# Altium project differential receiver.PrjPcb
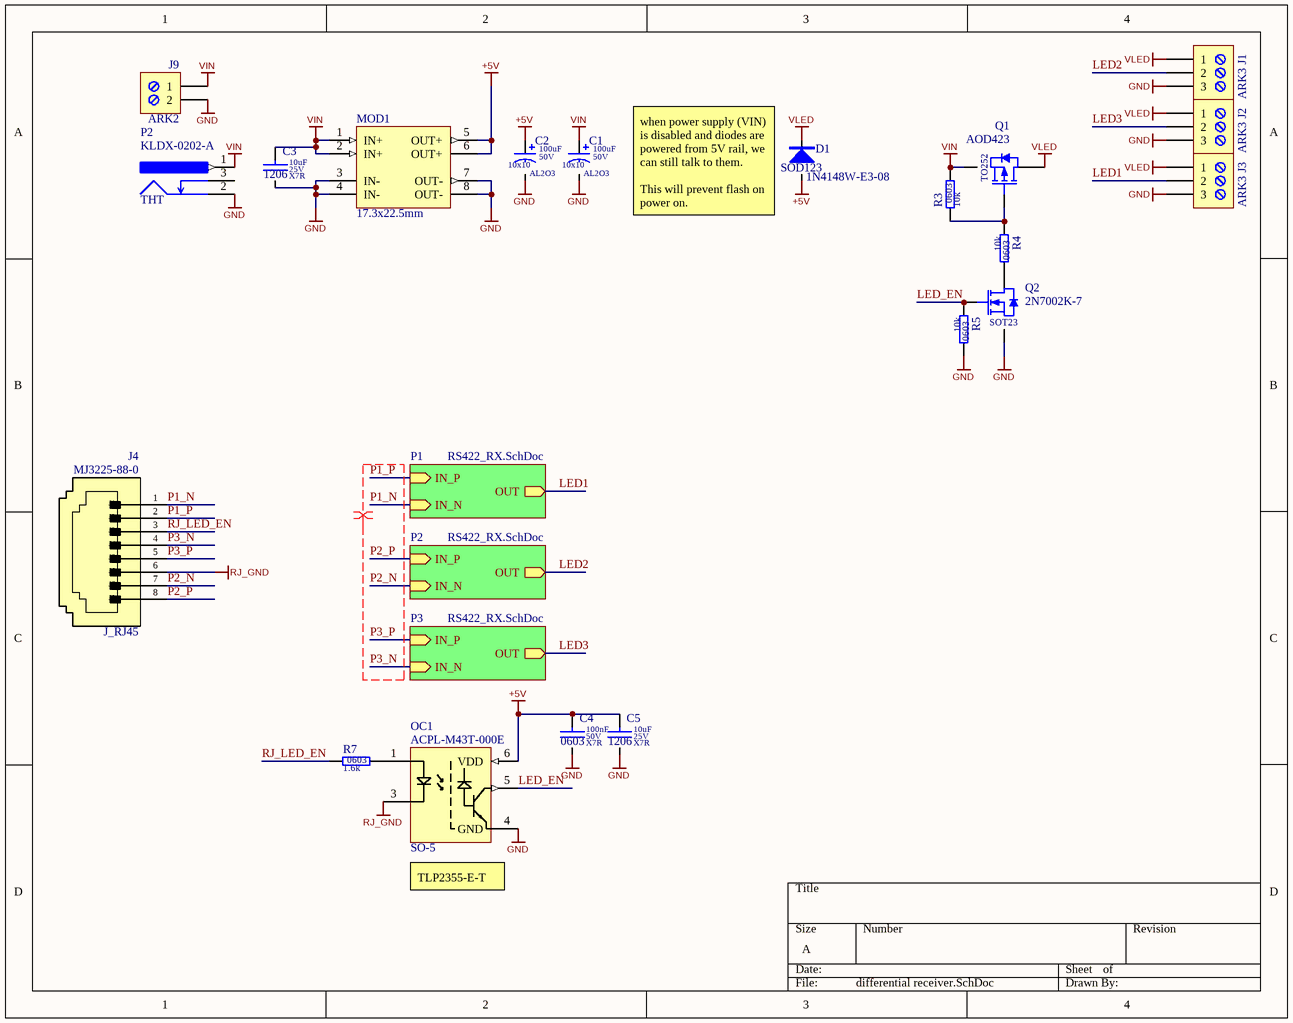
[diagram p0: differential receiver.SchDoc]
2 sheets, 38 parts. Net scope: hierarchical (ports join the sheet entries above them; power ports are global).
Board file: differential receiver.PcbDoc
Sheets:
  differential receiver.SchDoc
    P1 = RS422_RX.SchDoc
    P2 = RS422_RX.SchDoc
    P3 = RS422_RX.SchDoc

## Sheet differential receiver.SchDoc
size A; SheetNumber: 1; SheetTotal: 2

### Parts
(Parts that share a designator on the sheet are numbered #1, #2 ... from top to bottom, then left to right.)
C1  value 100uF  Dielectric: AL2O3  SCH_Footprint: 10x10  Voltage: 50V  [CE_D_10x10_SMD]  (hidden comment: Electrolytic Capacitor)
C2  value 100uF  Dielectric: AL2O3  SCH_Footprint: 10x10  Voltage: 50V  [CE_D_10x10_SMD]  (hidden comment: Electrolytic Capacitor)
C3  value 10uF  Dielectric: X7R  Voltage: 25V  SCH_Footprint: 1206  [C_1206_3216]  (hidden comment: Ceramic X7R)
C4#1  value 100nF  Dielectric: X7R  Voltage: 50V  SCH_Footprint: 0603  [C_0603_1608]  (hidden comment: Ceramic X7R)
C5#1  value 10uF  Dielectric: X7R  Voltage: 25V  SCH_Footprint: 1206  [C_1206_3216]  (hidden comment: Ceramic X7R)
D1  value 1N4148W-E3-08  [SOD123]  (hidden comment: 1N4148W)
J1  ARK3  [J_ARK3]
J2  ARK3  [J_ARK3]
J3  ARK3  [J_ARK3]
J4  value MJ3225-88-0  [J_RJ45_MJ3225-88-0]  (hidden comment: Modular Connector, Modular Jack, 1 x 1 (Port), 8P8C, Cat3)
J9  ARK2  [J_ARK2]
MOD1  SCH_Footprint: 17.3x22.5mm  [MOD_BUCK_MP1584]  (hidden comment: Low cost, Aliexpress-ready DC-DC buck converter using MP1584)
OC1  value ACPL-M43T-000E  [SO-5]  (hidden comment: Optocoupler DC-IN 1-CH Transistor With Base DC-OUT Automotive)
P2  value KLDX-0202-A  SCH_Footprint: THT  [P_KLDX-0202-A]  (hidden comment: DC JACK)
Q1  SCH_Footprint: TO252  [DPAK_TO252-3_SC63_M]  (hidden comment: AOD423)
Q2  SCH_Footprint: SOT23  [SOT23_TO236_SC59]  (hidden comment: 2N7002K-7)
R3  value 10k  SCH_Footprint: 0603  [R_0603_1608]  (hidden comment: Resistor)
R4  value 10k  SCH_Footprint: 0603  [R_0603_1608]  (hidden comment: Resistor)
R5  value 10k  SCH_Footprint: 0603  [R_0603_1608]  (hidden comment: Resistor)
R7#1  value 1.6k  SCH_Footprint: 0603  [R_0603_1608]  (hidden comment: Resistor)

### Sub-sheets
P1 = RS422_RX.SchDoc: OUT (out), IN_P (in), IN_N (in)
P2 = RS422_RX.SchDoc: OUT (out), IN_P (in), IN_N (in)
P3 = RS422_RX.SchDoc: OUT (out), IN_P (in), IN_N (in)

### Nets
+5V: C2.1 C4#1.1 C5#1.1 D1.2 MOD1.5(OUT+) MOD1.6(OUT+) OC1.6(VDD)
GND: C1.2 C2.2 C3.2 C4#1.2 C5#1.2 J1.3 J2.3 J3.3 J9.2 MOD1.3(IN-) MOD1.4(IN-) MOD1.7(OUT-) MOD1.8(OUT-) OC1.4(GND) P2.2 Q2.2(S) R5.2
RJ_GND: J4.6 OC1.3
VIN: C1.1 C3.1 J9.1 MOD1.1(IN+) MOD1.2(IN+) P2.1 Q1.3(S) R3.2
VLED: D1.1 J1.1 J2.1 J3.1 Q1.2(D)
LED1: J3.2 ; sheet P1/OUT
LED2: J1.2 ; sheet P2/OUT
LED3: J2.2 ; sheet P3/OUT
LED_EN: OC1.5 Q2.1(G) R5.1
P1_N: J4.1 ; sheet P1/IN_N
P1_P: J4.2 ; sheet P1/IN_P
P2_N: J4.7 ; sheet P2/IN_N
P2_P: J4.8 ; sheet P2/IN_P
P3_N: J4.4 ; sheet P3/IN_N
P3_P: J4.5 ; sheet P3/IN_P
RJ_LED_EN: J4.3 R7#1.1
NetOC1_1: OC1.1 R7#1.2
NetQ1_1: Q1.1(G) R3.1 R4.1
NetQ2_3: Q2.3(D) R4.2

Not connected (* = marked no-connect by the designer): P2 3

### Layout directives
differential pair: P1_N, P1_P, P2_N, P2_P, P3_N, P3_P

### Notes on the sheet
- (near D1) when power supply (VIN) is disabled and diodes are powered from 5V rail, we can still talk to them.
  This will prevent flash on power on.
- (near OC1) TLP2355-E-T
- (in symbol J_RJ45_MJ3225-88-0) J1; J2; J3; J5; J6; J7; J8

### Library data of the parts
C1 C2 = CE_100uF_50V_AL2O3_10x10_20: Polarized Capacitor; Manufacturer: Nichicon; Manufacturer Part Number: UUX1H101MNL1GS; Tolerance (%): 20; Part Number: CE_100uF_50V_AL2O3_10x10_20; HelpURL: https://datasheet.octopart.com/UUX1H101MNL1GS-Nichicon-datasheet-62047998.pdf; Supplier 1: TME; Supplier Part Number 1: UUX1H101MNL1GS; Supplier 2: RS Components; Supplier Part Number 2: 7393107; Supplier 3: Farnell; Supplier Part Number 3: 2841943; Supplier 4: Mouser; Supplier Part Number 4: 647-UUX1H101MNL1GS; Supplier 5: Digi-Key; Supplier Part Number 5: 493-6269-1-ND; Supplier 6: LCSC
C3 C5#1 = C_10uF_25V_X7R_1206_10: Capacitor; Manufacturer: Samsung; Manufacturer Part Number: CL31B106KAHNNNE; Tolerance (%): 10; Part Number: C_10uF_25V_X7R_1206_10; HelpURL: http://www.tme.eu/pl/Document/4a42202b32dab16128fe107dd69598cc/samsung-chip-cap.pdf; Supplier 1: TME; Supplier Part Number 1: CL31B106KAHNNNE; Supplier 2: RS Components; Supplier Part Number 2: 766-6773; Supplier 3: Farnell; Supplier Part Number 3: 3013526; Supplier 4: Mouser; Supplier Part Number 4: 187-CL31B106KAHNNNE; Supplier 5: Digi-Key; Supplier Part Number 5: 1276-1804-1-ND; Supplier 6: LCSC
C4#1 = C_100nF_50V_X7R_0603_5: Capacitor; Manufacturer: Samsung; Manufacturer Part Number: CL10B104JB8NNNC; Tolerance (%): 5; Part Number: C_100nF_50V_X7R_0603_5; HelpURL: http://www.tme.eu/pl/Document/4a42202b32dab16128fe107dd69598cc/samsung-chip-cap.pdf; Supplier 1: TME; Supplier Part Number 1: CL10B104JB8NNNC; Supplier 2: RS Components; Supplier Part Number 2: 7665455; Supplier 3: Farnell; Supplier 4: Mouser; Supplier 5: Digi-Key; Supplier Part Number 5: 1276-1033-1-ND; Supplier 6: LCSC; Supplier Part Number 6: C24452
D1 = D_1N4148W_0A15_75V_SOD123: Manufacturer: Vishay; Voltage: 75; Current: 0.15A; SCH_Footprint: SOD123; Part Number: D_1N4148W_0A15_75V_SOD123; HelpURL: https://datasheet.octopart.com/1N4148W-E3-08-Vishay-datasheet-17291302.pdf; Manufacturer Part Number: 1N4148W-E3-08; Supplier 1: TME; Supplier Part Number 1: 1N4148W-E3-08; Supplier 2: RS Components; Supplier Part Number 2: 7003671; Supplier 3: Farnell; Supplier Part Number 3: 2433353; Supplier 4: Mouser; Supplier Part Number 4: 78-1N4148W-E3-08; Supplier 5: Digi-Key; Supplier Part Number 5: 1N4148W-E3-08CT-ND; Supplier 6: LCSC
J1-J3 = J_TB-5.0-P-3P: ARK Screw terminal, 3-Pin; Manufacturer: DEGSON ELECTRONICS; Value: DG301-5.0-03P-12-18A(H); SCH_Footprint: ARK3; Part Number: J_TB-5.0-P-3P; HelpURL: https://datasheet.octopart.com/DG301-5.0-03P-12-18A%28H%29-Degson-datasheet-17801202.pdf; Manufacturer Part Number: DG301-5.0-03P-12-18A(H); Supplier 1: TME; Supplier Part Number 1: DG301-5.0-3/6B; Supplier 2: RS Components; Supplier 3: Farnell; Supplier 4: Mouser; Supplier 5: Digi-Key; Supplier 6: LCSC
J4 = J_RJ45_MJ3225-88-0: Manufacturer: Global Connector Technology; SCH_Footprint: J_RJ45; Part Number: J_RJ45_MJ3225-88-0; HelpURL: https://www.farnell.com/cad/3781788.pdf; Manufacturer Part Number: MJ3225-88-0; Supplier 1: TME; Supplier 2: RS Components; Supplier 3: Farnell; Supplier Part Number 3: 4071641; Supplier 4: Mouser; Supplier 5: Digi-Key; Supplier 6: LCSC; Supplier 7: Newark; Supplier Part Number 7: 61AK4308
J9 = J_TB-5.0-P-2P: ARK Screw terminal, 2-Pin; Manufacturer: DEGSON ELECTRONICS; Value: DG301-5.0-02P-12-18A(H); SCH_Footprint: ARK2; Part Number: J_TB-5.0-P-2P; HelpURL: https://datasheet.octopart.com/DG301-5.0-03P-12-18A%28H%29-Degson-datasheet-17801202.pdf; Manufacturer Part Number: DG301-5.0-02P-12-18A(H); Supplier 1: TME; Supplier Part Number 1: DG301-5.0-2/6B; Supplier 2: RS Components; Supplier 3: Farnell; Supplier 4: Mouser; Supplier 5: Digi-Key; Supplier 6: LCSC
MOD1 = MOD_BUCK_MP1584: Value: -; Part Number: MOD_BUCK_MP1584; HelpURL: https://pl.aliexpress.com/item/32341006065.html; Manufacturer: -; Manufacturer Part Number: -; Supplier 1: TME; Supplier 2: RS Components; Supplier 3: Farnell; Supplier 4: Mouser; Supplier 5: Digi-Key; Supplier 6: LCSC; Supplier 7: -; Supplier Part Number 7: -
OC1 = OC_ACPL-M43T-000E: Manufacturer: Broadcom; SCH_Footprint: SO-5; Part Number: OC_ACPL-M43T-000E; HelpURL: https://datasheet.octopart.com/ACPL-M43T-000E-Broadcom-datasheet-68302489.pdf; Manufacturer Part Number: ACPL-M43T-000E; Supplier 1: TME; Supplier 2: RS Components; Supplier 3: Farnell; Supplier Part Number 3: 1244509; Supplier 4: Mouser; Supplier Part Number 4: 630-ACPL-M43T-000E; Supplier 5: Digi-Key; Supplier Part Number 5: 516-2256-5-ND; Supplier 6: LCSC
P2 = P_KLDX-0202-A: Typical 3-pin jack power connector with switch; Manufacturer: Kycon; Part Number: P_KLDX-0202-A; HelpURL: http://www.kycon.com/2013Catalogpage/DC%20Power/KLDX_0202.pdf; Manufacturer Part Number: KLDX-0202-A; Supplier 1: TME; Supplier 2: RS Components; Supplier 3: Farnell; Supplier Part Number 3: 2839850; Supplier 4: Mouser; Supplier Part Number 4: 806-KLDX-0202-A; Supplier 5: Digi-Key; Supplier Part Number 5: 2092-KLDX-0202-A-ND; Supplier 6: LCSC
Q1 = QP_AOD423: Manufacturer: Alpha&Omega Semiconductor; Type: P-MOS; Voltage: 30V; Current: 67A; Value: AOD423; Part Number: QP_AOD423; HelpURL: https://www.aosmd.com/sites/default/files/res/datasheets/AOI423.pdf; Manufacturer Part Number: AOD423; Supplier 1: TME; Supplier Part Number 1: AOD423; Supplier 2: RS Components; Supplier 3: Farnell; Supplier 4: Mouser; Supplier 5: Digi-Key; Supplier 6: LCSC
Q2 = QN_2N7002K-7: Manufacturer: Diodes Inc; Type: N-MOS; Voltage: 60V; Current: 0A8; Value: 2N7002K-7; Part Number: QN_2N7002K-7; HelpURL: http://datasheet.octopart.com/2N7002K-7-Diodes-Inc.-datasheet-12515815.pdf; Manufacturer Part Number: 2N7002K-7; Supplier 1: TME; Supplier 2: RS Components; Supplier Part Number 2: 7703383; Supplier 3: Farnell; Supplier Part Number 3: 1713825; Supplier 4: Mouser; Supplier Part Number 4: 621-2N7002K-7; Supplier 5: Digi-Key; Supplier Part Number 5: 2N7002K-7DICT-ND; Supplier 6: LCSC
R3-R5 = R_10k_0603_1: Manufacturer: Vishay; Manufacturer Part Number: CRCW060310K0FKTA; Voltage: 75V; Power: 100mW; Tolerance: 1%; Part Number: R_10k_0603_1; HelpURL: https://octopart.com/datasheet/crcw060310k0fkta-vishay-39447548; Supplier 1: TME; Supplier Part Number 1: CRCW060310K0FKTABC; Supplier 2: RS Components; Supplier 3: Farnell; Supplier Part Number 3: 1652827; Supplier 4: Mouser; Supplier Part Number 4: 71-CRCW0603-10K; Supplier 5: Digi-Key; Supplier Part Number 5: 541-2980-1-ND; Supplier 6: LCSC
R7#1 = R_1.6k_0603_1_AECQ0: Manufacturer: Panasonic; Manufacturer Part Number: ERJ-3EKF1601V; Voltage: 75V; Power: 100mW; Tolerance: 1%; Part Number: R_1.6k_0603_1_AECQ0; HelpURL: https://industrial.panasonic.com/cdbs/www-data/pdf/RDA0000/AOA0000C304.pdf; Supplier 1: TME; Supplier Part Number 1: ERJ3EKF1601V; Supplier 2: RS Components; Supplier 3: Farnell; Supplier Part Number 3: 2303159; Supplier 4: Mouser; Supplier Part Number 4: 667-ERJ-3EKF1601V; Supplier 5: Digi-Key; Supplier Part Number 5: P1.60KHCT-ND; Supplier 6: LCSC

## Sheet RS422_RX.SchDoc
size A; SheetNumber: 2; SheetTotal: 2
Used 3 times, as channels P1, P2, P3. Parts and nets are listed once, with the designators drawn on the sheet.
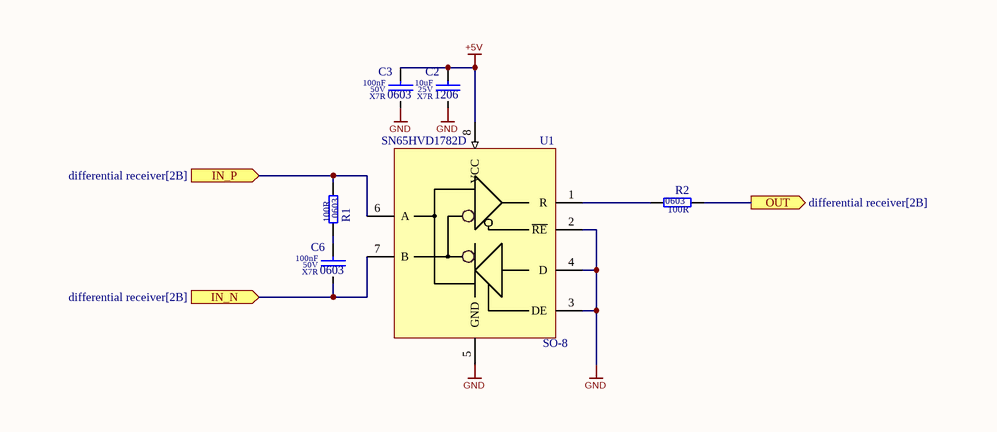
[diagram p1: RS422_RX.SchDoc]

### Parts
C2  value 10uF  Dielectric: X7R  Voltage: 25V  SCH_Footprint: 1206  [C_1206_3216]  (hidden comment: Ceramic X7R)
C3  value 100nF  Dielectric: X7R  Voltage: 50V  SCH_Footprint: 0603  [C_0603_1608]  (hidden comment: Ceramic X7R)
C6  value 100nF  Dielectric: X7R  Voltage: 50V  SCH_Footprint: 0603  [C_0603_1608]  (hidden comment: Ceramic X7R)
R1  value 100R  SCH_Footprint: 0603  [R_0603_1608]  (hidden comment: Resistor)
R2  value 100R  SCH_Footprint: 0603  [R_0603_1608]  (hidden comment: Resistor)
U1  value SN65HVD1782D  SCH_Footprint: SO-8  [SOP8_SO8_SOIC8_4X5X18]  (hidden comment: Transceiver)

### Ports
IN_N (in, see differential receiver[2B]), IN_P (in, see differential receiver[2B]), OUT (out, see differential receiver[2B])

### Nets
+5V: C2.1 C3.1 U1.8(VCC)
GND: C2.2 C3.2 U1.2(~{RE}) U1.3(DE) U1.4(D) U1.5(GND)
IN_N: C6.2 U1.7(B) ; port IN_N
IN_P: R1.2 U1.6(A) ; port IN_P
OUT: R2.1 ; port OUT
NetC6_1: C6.1 R1.1
NetR2_2: R2.2 U1.1(R)

### Channels
P1: designators C2=C5#2 C3=C4#2 C6=C12 R1=R6 R2=R7#2 U1=U1; ports IN_N=P1_N IN_P=P1_P OUT=LED1
P2: designators C2=C7 C3=C6 C6=C13 R1=R8 R2=R9 U1=U2; ports IN_N=P2_N IN_P=P2_P OUT=LED2
P3: designators C2=C9 C3=C8 C6=C14 R1=R10 R2=R11 U1=U3; ports IN_N=P3_N IN_P=P3_P OUT=LED3

### Library data of the parts
C2 = C_10uF_25V_X7R_1206_10: as C3 on sheet differential receiver; Part Number: C_10uF_25V_X7R_1206_10; HelpURL: http://www.tme.eu/pl/Document/4a42202b32dab16128fe107dd69598cc/samsung-chip-cap.pdf; Supplier 1: TME; Supplier Part Number 1: CL31B106KAHNNNE; Supplier 2: RS Components; Supplier Part Number 2: 766-6773; Supplier 3: Farnell; Supplier Part Number 3: 3013526; Supplier 4: Mouser; Supplier Part Number 4: 187-CL31B106KAHNNNE; Supplier 5: Digi-Key; Supplier Part Number 5: 1276-1804-1-ND; Supplier 6: LCSC
C3 C6 = C_100nF_50V_X7R_0603_5: as C4#1 on sheet differential receiver; Part Number: C_100nF_50V_X7R_0603_5; HelpURL: http://www.tme.eu/pl/Document/4a42202b32dab16128fe107dd69598cc/samsung-chip-cap.pdf; Supplier 1: TME; Supplier Part Number 1: CL10B104JB8NNNC; Supplier 2: RS Components; Supplier Part Number 2: 7665455; Supplier 3: Farnell; Supplier 4: Mouser; Supplier 5: Digi-Key; Supplier Part Number 5: 1276-1033-1-ND; Supplier 6: LCSC; Supplier Part Number 6: C24452
R1 = R_100R_0603_1_AECQ0: Manufacturer: Panasonic; Manufacturer Part Number: ERJ-3EKF1000V; Voltage: 75V; Power: 100mW; Tolerance: 1%; AEC-Q: 0; Part Number: R_100R_0603_1_AECQ0; HelpURL: https://industrial.panasonic.com/cdbs/www-data/pdf/RDA0000/AOA0000C304.pdf; Supplier 1: TME; Supplier Part Number 1: ERJ3EKF1000V; Supplier 2: RS Components; Supplier 3: Farnell; Supplier Part Number 3: 2303059; Supplier 4: Mouser; Supplier Part Number 4: 667-ERJ-3EKF1000V; Supplier 5: Digi-Key; Supplier Part Number 5: P100HCT-ND; Supplier 6: LCSC; Supplier Part Number 6: C193336
R2 = R_100R_0603_1: Manufacturer: Yageo; Manufacturer Part Number: RC0603FR-07100RL; Voltage: 50V; Power: 100mW; Tolerance: 1%; Part Number: R_100R_0603_1; HelpURL: http://www.tme.eu/en/Document/d2a72e545e5c8eb7bf2a04fa97535928/rc0603yageo.pdf; Supplier 1: TME; Supplier Part Number 1: RC0603FR-07100R; Supplier 2: RS Components; Supplier 3: Farnell; Supplier Part Number 3: 2131804; Supplier 4: Mouser; Supplier Part Number 4: 603-RC0603FR-07100RL; Supplier 5: Digi-Key; Supplier Part Number 5: 311-100HRCT-ND; Supplier 6: LCSC
U1 = U_SN65HVD1782DR: Fault-Protected  RS-485  Transceivers  With 3.3-V to 5-V Operation; Manufacturer: Texas Instruments; Part Number: U_SN65HVD1782DR; HelpURL: http://www.ti.com/lit/ds/slls877h/slls877h.pdf; Manufacturer Part Number: SN65HVD1782D; Supplier 1: TME; Supplier 2: RS Components; Supplier Part Number 2: 7093179P; Supplier 3: Farnell; Supplier Part Number 3: 1755056; Supplier 4: Mouser; Supplier Part Number 4: 595-SN65HVD1782D; Supplier 5: Digi-Key; Supplier Part Number 5: 296-33574-5-ND; Supplier 6: LCSC

## Nets that join several sheets
+5V: differential receiver (7 pins), P1 (C4#2.1 C5#2.1 U1.8), P2 (C6.1 C7.1 U2.8), P3 (C8.1 C9.1 U3.8)
GND: differential receiver (17 pins), P1 (6 pins), P2 (6 pins), P3 (6 pins)
LED1: differential receiver (J3.2), P1 (R7#2.1)
LED2: differential receiver (J1.2), P2 (R9.1)
LED3: differential receiver (J2.2), P3 (R11.1)
P1_N: differential receiver (J4.1), P1 (C12.2 U1.7)
P1_P: differential receiver (J4.2), P1 (R6.2 U1.6)
P2_N: differential receiver (J4.7), P2 (C13.2 U2.7)
P2_P: differential receiver (J4.8), P2 (R8.2 U2.6)
P3_N: differential receiver (J4.4), P3 (C14.2 U3.7)
P3_P: differential receiver (J4.5), P3 (R10.2 U3.6)

## Assembly variants
now: not fitted C1 C2 C3 C4 C5 C8 C9 C11 D1 J1 J2 J3 J4 MOD1 P1 Q1 Q2 R2 R3 R4 R6 R7 R10 R11 U1 U3